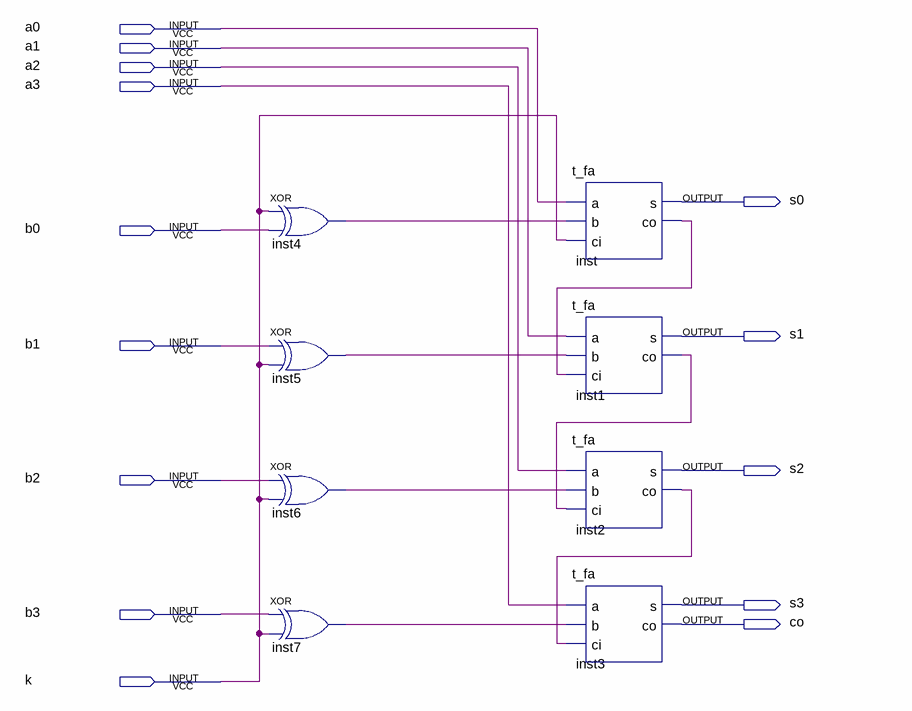
[diagram p0: schematic sheet]
// Quartus schematic t4bit_as.bdf as structural Verilog: 8 symbols, 14 pins
module t4bit_as (
  input  a0,
  input  a1,
  input  a2,
  input  a3,
  input  b0,
  input  b1,
  input  b2,
  input  b3,
  input  k,
  output s0,
  output s1,
  output s2,
  output s3,
  output co
);

  wire inst1_co, inst2_co, inst4_out, inst5_out, inst6_out, inst7_out, inst_co;

  xor inst4 (inst4_out, k, b0);
  xor inst5 (inst5_out, b1, k);
  xor inst6 (inst6_out, b2, k);
  xor inst7 (inst7_out, b3, k);
  t_fa inst (.a(a0), .b(inst4_out), .ci(k), .s(s0), .co(inst_co));
  t_fa inst1 (.a(a1), .b(inst5_out), .ci(inst_co), .s(s1), .co(inst1_co));
  t_fa inst2 (.a(a2), .b(inst6_out), .ci(inst1_co), .s(s2), .co(inst2_co));
  t_fa inst3 (.a(a3), .b(inst7_out), .ci(inst2_co), .s(s3), .co(co));
endmodule
